# Altium project 海关全向控制器主控板V2.PrjPcb
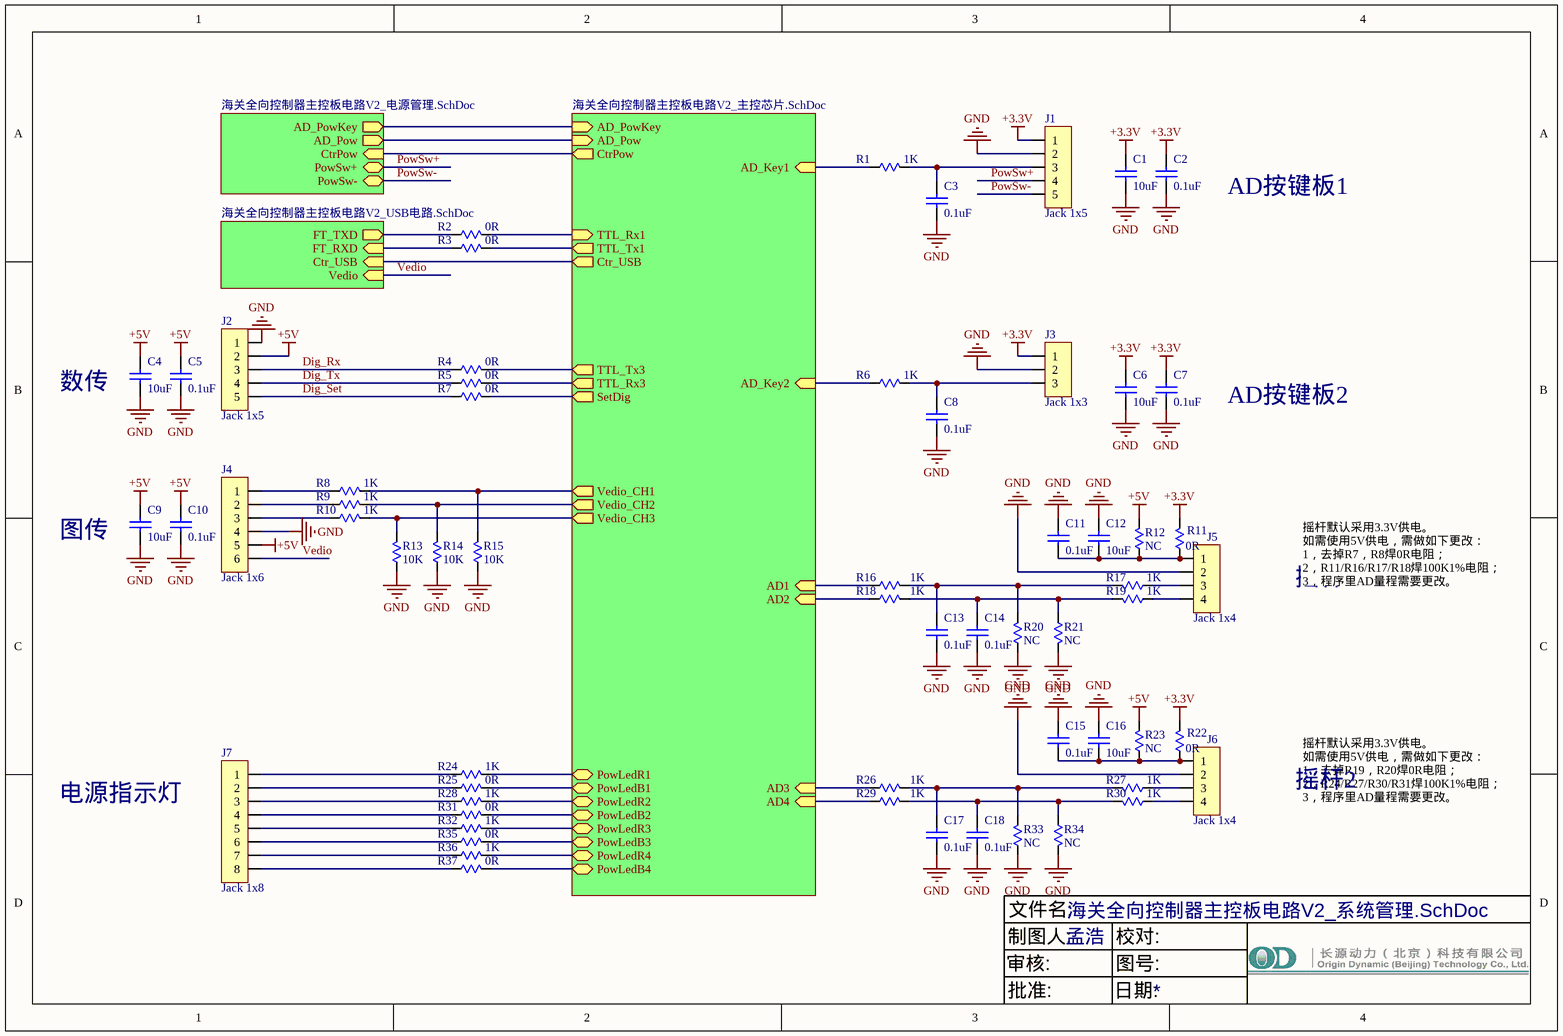
[diagram p0: 海关全向控制器主控板电路V2_系统管理.SchDoc]
4 sheets, 192 parts. Net scope: hierarchical (ports join the sheet entries above them; power ports are global).
Board file: 海关全向控制器主控板电路V2.PcbDoc
Sheets:
  海关全向控制器主控板电路V2_系统管理.SchDoc
    Designator = 海关全向控制器主控板电路V2_电源管理.SchDoc
    Designator = 海关全向控制器主控板电路V2_USB电路.SchDoc
    Designator = 海关全向控制器主控板电路V2_主控芯片.SchDoc

## Sheet 海关全向控制器主控板电路V2_系统管理.SchDoc
size A4

### Parts
C1  10uF  [C0603]
C2  0.1uF  [C0603]
C3  0.1uF  [C0603]
C4  10uF  [C0603]
C5  0.1uF  [C0603]
C6  10uF  [C0603]
C7  0.1uF  [C0603]
C8  0.1uF  [C0603]
C9  10uF  [C0603]
C10  0.1uF  [C0603]
C11  0.1uF  [C0603]
C12  10uF  [C0603]
C13  0.1uF  [C0603]
C14  0.1uF  [C0603]
C15  0.1uF  [C0603]
C16  10uF  [C0603]
C17  0.1uF  [C0603]
C18  0.1uF  [C0603]
J1  Jack 1x5  [ZH-5AWD]
J2  Jack 1x5  [ZH-5AWD]
J3  Jack 1x3  [ZH-3AWD]
J4  Jack 1x6  [ZH-6AWD]
J5  Jack 1x4  [ZH-4AWD]
J6  Jack 1x4  [ZH-4AWD]
J7  Jack 1x8  [ZH-8AWD]
R1  1K  [R0603]
R2  0R  [R0603]
R3  0R  [R0603]
R4  0R  [R0603]
R5  0R  [R0603]
R6  1K  [R0603]
R7  0R  [R0603]
R8  1K  [R0603]
R9  1K  [R0603]
R10  1K  [R0603]
R11  0R  [R0603]
R12  NC  [R0603]
R13  10K  [R0603]
R14  10K  [R0603]
R15  10K  [R0603]
R16  1K  [R0603]
R17  1K  [R0603]
R18  1K  [R0603]
R19  1K  [R0603]
R20  NC  [R0603]
R21  NC  [R0603]
R22  0R  [R0603]
R23  NC  [R0603]
R24  1K  [R0603]
R25  0R  [R0603]
R26  1K  [R0603]
R27  1K  [R0603]
R28  1K  [R0603]
R29  1K  [R0603]
R30  1K  [R0603]
R31  0R  [R0603]
R32  1K  [R0603]
R33  NC  [R0603]
R34  NC  [R0603]
R35  0R  [R0603]
R36  1K  [R0603]
R37  0R  [R0603]

### Sub-sheets
Designator = 海关全向控制器主控板电路V2_电源管理.SchDoc: AD_PowKey (out), AD_Pow (out), CtrPow (in), PowSw+ (bidir), PowSw- (bidir)
Designator = 海关全向控制器主控板电路V2_USB电路.SchDoc: FT_RXD (in), FT_TXD (out), Vedio (in), Ctr_USB (in)
Designator = 海关全向控制器主控板电路V2_主控芯片.SchDoc: AD_PowKey (in), AD_Pow (in), CtrPow (out), TTL_Rx1 (in), TTL_Tx1 (out), AD_Key1 (in), AD1 (in), AD2 (in), AD3 (in), AD4 (in), TTL_Tx3 (out), TTL_Rx3 (out), Vedio_CH1 (out), Vedio_CH2 (out), Vedio_CH3 (out), AD_Key2 (in), PowLedR1 (bidir), PowLedR2 (bidir), PowLedR3 (bidir), PowLedB1 (bidir), PowLedB2 (bidir), PowLedB3 (bidir), SetDig (out), Ctr_USB (out), PowLedR4 (bidir), PowLedB4 (bidir)

### Nets
+3.3V: C1.1 C2.1 C6.1 C7.1 J1.1 J3.1 R11.1 R22.1
+5V: C4.1 C5.1 C9.1 C10.1 J2.2 J4.5 R12.1 R23.1
GND: C1.2 C2.2 C3.2 C4.2 C5.2 C6.2 C7.2 C8.2 C9.2 C10.2 C11.1 C12.1 C13.2 C14.2 C15.1 C16.1 C17.2 C18.2 J1.2 J2.1 J3.2 J4.4 J5.2 J6.2 R13.1 R14.1 R15.1 R20.2 R21.1 R33.2 R34.1
AD1: R16.2 ; sheet Designator/AD1
AD2: R18.2 ; sheet Designator/AD2
AD3: R26.2 ; sheet Designator/AD3
AD4: R29.2 ; sheet Designator/AD4
AD_Key1: R1.1 ; sheet Designator/AD_Key1
AD_Key2: R6.1 ; sheet Designator/AD_Key2
AD_Pow: sheet Designator/AD_Pow, sheet Designator/AD_Pow
AD_PowKey: sheet Designator/AD_PowKey, sheet Designator/AD_PowKey
Ctr_USB: sheet Designator/Ctr_USB, sheet Designator/Ctr_USB
CtrPow: sheet Designator/CtrPow, sheet Designator/CtrPow
Dig_Rx: J2.3 R4.1
Dig_Set: J2.5 R7.1
Dig_Tx: J2.4 R5.1
PowLedB1: R25.2 ; sheet Designator/PowLedB1
PowLedB2: R31.2 ; sheet Designator/PowLedB2
PowLedB3: R35.2 ; sheet Designator/PowLedB3
PowLedB4: R37.2 ; sheet Designator/PowLedB4
PowLedR1: R24.2 ; sheet Designator/PowLedR1
PowLedR2: R28.2 ; sheet Designator/PowLedR2
PowLedR3: R32.2 ; sheet Designator/PowLedR3
PowLedR4: R36.2 ; sheet Designator/PowLedR4
PowSw+: J1.4 ; sheet Designator/PowSw+
PowSw-: J1.5 ; sheet Designator/PowSw-
SetDig: R7.2 ; sheet Designator/SetDig
TTL_Rx1: R2.1 ; sheet Designator/TTL_Rx1
TTL_Rx3: R5.2 ; sheet Designator/TTL_Rx3
TTL_Tx1: R3.1 ; sheet Designator/TTL_Tx1
TTL_Tx3: R4.2 ; sheet Designator/TTL_Tx3
Vedio: J4.6 ; sheet Designator/Vedio
Vedio_CH1: R8.2 R15.2 ; sheet Designator/Vedio_CH1
Vedio_CH2: R9.2 R14.2 ; sheet Designator/Vedio_CH2
Vedio_CH3: R10.2 R13.2 ; sheet Designator/Vedio_CH3
NetC3_1: C3.1 J1.3 R1.2
NetC8_1: C8.1 J3.3 R6.2
NetC11_2: C11.2 C12.2 J5.1 R11.2 R12.2
NetC13_1: C13.1 R16.1 R17.1 R20.1
NetC14_1: C14.1 R18.1 R19.1 R21.2
NetC15_2: C15.2 C16.2 J6.1 R22.2 R23.2
NetC17_1: C17.1 R26.1 R27.1 R33.1
NetC18_1: C18.1 R29.1 R30.1 R34.2
NetJ4_1: J4.1 R8.1
NetJ4_2: J4.2 R9.1
NetJ4_3: J4.3 R10.1
NetJ5_3: J5.3 R17.2
NetJ5_4: J5.4 R19.2
NetJ6_3: J6.3 R27.2
NetJ6_4: J6.4 R30.2
NetJ7_1: J7.1 R24.1
NetJ7_2: J7.2 R25.1
NetJ7_3: J7.3 R28.1
NetJ7_4: J7.4 R31.1
NetJ7_5: J7.5 R32.1
NetJ7_6: J7.6 R35.1
NetJ7_7: J7.7 R36.1
NetJ7_8: J7.8 R37.1
NetR2_2: R2.2 ; sheet Designator/FT_TXD
NetR3_2: R3.2 ; sheet Designator/FT_RXD

### Notes on the sheet
- AD按键板1
- 数传
- AD按键板2
- 图传
- 摇杆默认采用3.3V供电。
  如需使用5V供电，需做如下更改：
  1，去掉R7，R8焊0R电阻；
  2，R11/R16/R17/R18焊100K1%电阻；
  3，程序里AD量程需要更改。
- 摇杆1
- 摇杆2
- 电源指示灯
- 摇杆默认采用3.3V供电。
  如需使用5V供电，需做如下更改：
  1，去掉R19，R20焊0R电阻；
  2，R24/R27/R30/R31焊100K1%电阻；
  3，程序里AD量程需要更改。
- 文件名:
- 审核:
- 制图人:
- 孟浩
- 校对:
- 图号:
- 批准:
- 日期:

### Library data of the parts
C1-C18 = Cap: Capacitor; Published: 8-Jun-2000; Revision: July-2002: Re-released for DXP Platform.; Publisher: Altium Limited
  C1 C4 C6 C9 C12 C16: Value: 10uF
  C2 C3 C5 C7 C8 C10 C11 C13-C15 C17 C18: Value: 0.1uF
J1 J2 = Jack 1x5: 插座
J3 = Jack 1x3: 插座
J4 = Jack 1x6: 插座
J5 J6 = Jack 1x4: 插座
J7 = Jack 1x8: 插座
R1-R37 = Res: Resistor; Published: 8-Jun-2000; LatestRevisionDate: 04-Mar-2005; LatestRevisionNote: PCB Footprint replaced.; PackageReference: J1-0603; Publisher: Altium Limited
  R1 R6 R8-R10 R16-R19 R26 R27 R29 R30: Value: 1K
  R2-R5 R7 R11 R22 R25 R31 R35 R37: Value: 0R
  R12 R20 R21 R23 R33 R34: Value: NC
  R13-R15: Value: 10K

## Sheet 海关全向控制器主控板电路V2_电源管理.SchDoc
size A4
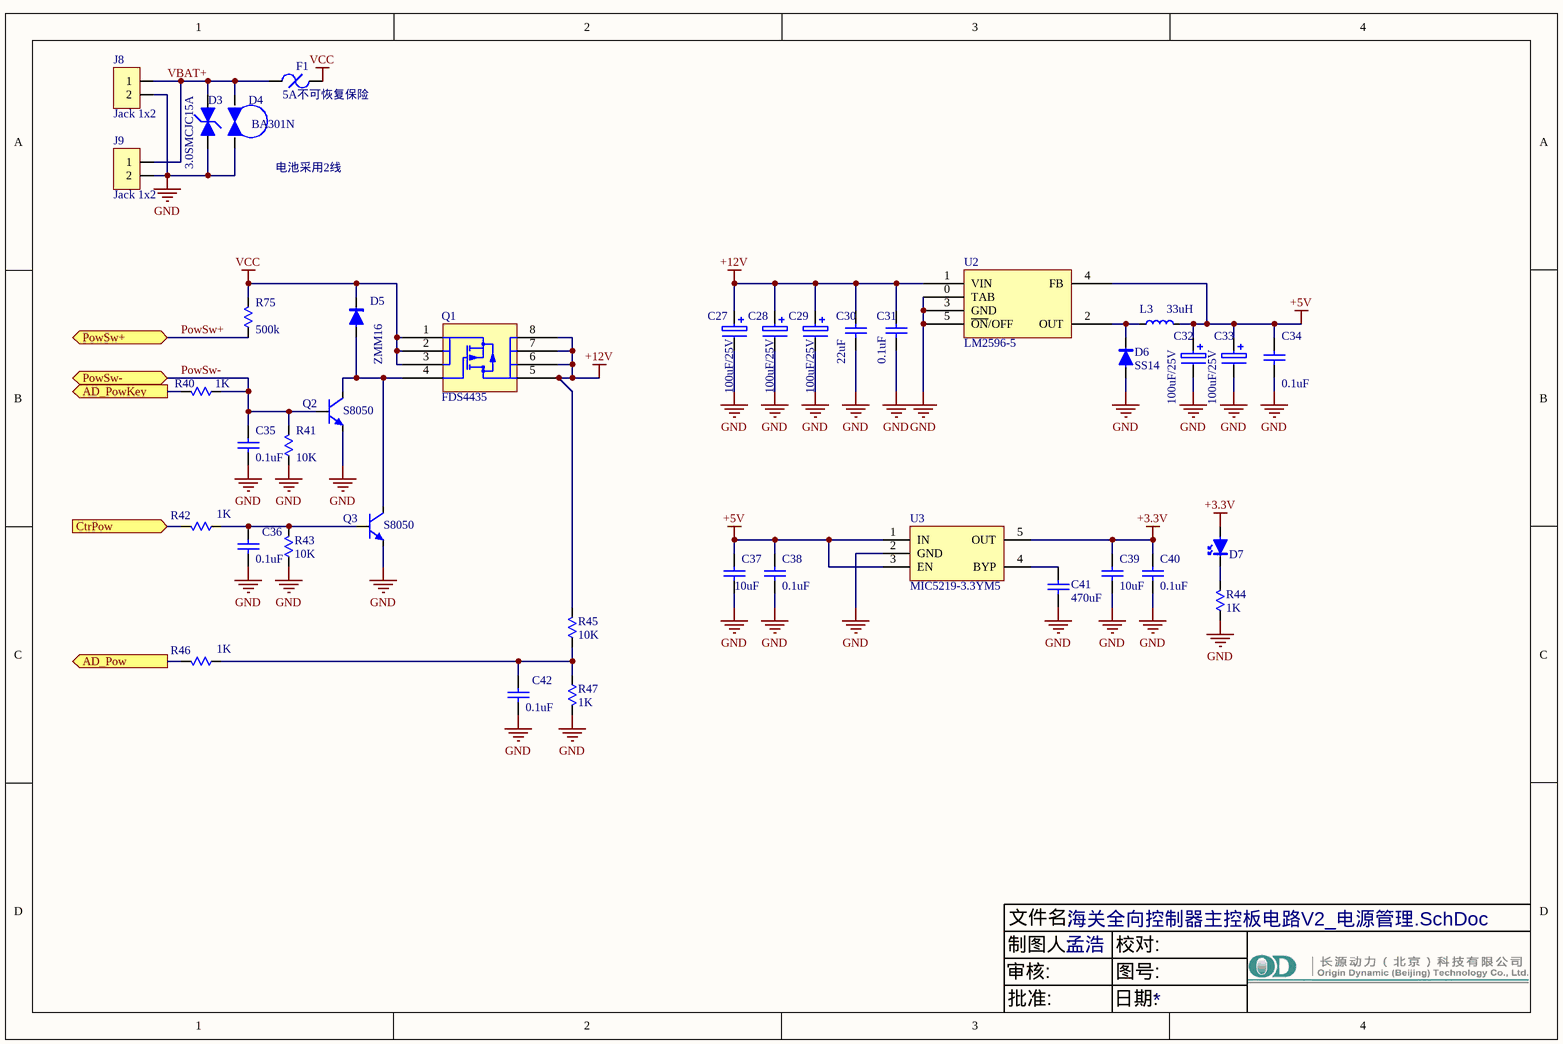
[diagram p1: 海关全向控制器主控板电路V2_电源管理.SchDoc]

### Parts
C27  100uF/25V  [C7343]
C28  100uF/25V  [C7343]
C29  100uF/25V  [C7343]
C30  22uF  [C1206]
C31  0.1uF  [C1206]
C32  100uF/25V  [C7343]
C33  100uF/25V  [C7343]
C34  0.1uF  [C0603]
C35  0.1uF  [C0603]
C36  0.1uF  [C0603]
C37  10uF  [C0603]
C38  0.1uF  [C0603]
C39  10uF  [C0603]
C40  0.1uF  [C0603]
C41  470uF  [C0603]
C42  0.1uF  [C0603]
D3  3.0SMCJC15A  [smc]
D4  BA301N  [BA301N]
D5  ZMM16  [SOD-80-S]
D6  SS14  [SMA]
D7  LED  [LED0603]  (value not drawn)
F1  5A不可恢复保险  [F1218]
J8  Jack 1x2  [ZH-2AWD]
J9  Jack 1x2  [ZH-2AWD]
L3  33uH  [L6.6*7.1mm]
Q1  FDS4435  [SO8]
Q2  S8050  [SOT-23]
Q3  S8050  [SOT-23]
R40  1K  [R0603]
R41  10K  [R0603]
R42  1K  [R0603]
R43  10K  [R0603]
R44  1K  [R0603]
R45  10K  [R0603]
R46  1K  [R0603]
R47  1K  [R0603]
R75  500k  [R0603]
U2  LM2596-5  [TO-263-5]
U3  MIC5219-3.3YM5  [SOT-23-5]

### Ports
AD_Pow (out), AD_PowKey (out), CtrPow (in), PowSw+ (bidir), PowSw- (bidir)

### Nets
+3.3V: C39.1 C40.2 D7.1(A) U3.5(OUT)
+5V: C32.1 C33.1 C34.2 C37.1 C38.2 L3.2 U2.4(FB) U3.1(IN) U3.3(EN)
+12V: C27.1 C28.1 C29.1 C30.1 C31.1 Q1.5 Q1.6 Q1.7 Q1.8 R45.1 U2.1(VIN)
GND: C27.2 C28.2 C29.2 C30.2 C31.2 C32.2 C33.2 C34.1 C35.1 C36.1 C37.2 C38.1 C39.2 C40.1 C41.1 C42.1 D3.2(K) D4.2 D6.1(A) J8.2 J9.2 Q2.2(E) Q3.2(E) R41.2 R43.2 R44.1 R47.1 U2.0(TAB) U2.3(GND) U2.5(~{ON}/OFF) U3.2(GND)
VCC: D5.2(K) F1.2 Q1.1 Q1.2 Q1.3 R75.2
AD_Pow: R46.1 ; port AD_Pow
AD_PowKey: R40.1 ; port AD_PowKey
CtrPow: R42.1 ; port CtrPow
PowSw+: R75.1 ; port PowSw+
PowSw-: C35.2 Q2.1(B) R40.2 R41.1 ; port PowSw-
VBAT+: D3.1(A) D4.1 F1.1 J8.1 J9.1
NetC36_2: C36.2 Q3.1(B) R42.2 R43.1
NetC41_2: C41.2 U3.4(BYP)
NetC42_2: C42.2 R45.2 R46.2 R47.2
NetD5_1: D5.1(A) Q1.4 Q2.3(C) Q3.3(C)
NetD6_2: D6.2(K) L3.1 U2.2(OUT)
NetD7_2: D7.2(K) R44.2

### Notes on the sheet
- 电池采用2线
- 文件名:
- 审核:
- 制图人:
- 孟浩
- 校对:
- 图号:
- 批准:
- 日期:

### Library data of the parts
C27-C29 = Cap Poll
C30 C31 C34-C40 C42 = CAP: Published: 8-Jun-2000; LatestRevisionDate: 17-Jul-2002; LatestRevisionNote: Re-released for DXP Platform.; PackageReference: RAD-0.3; Publisher: Altium Limited
  C30: Value: 22uF
  C31 C34-C36 C38 C40 C42: Value: 0.1uF
  C37 C39: Value: 10uF
C32 C33 = ELECTRO: Electrolytic Capacitor
C41 = Cap Semi
D3 = Diode-TVS
D5 = DIODE-ZENER: Small Signal Zener Diodes
D6 = Diode-Switch: Silicon Epitaxial Planar Diodes
F1 = Fuse2
J8 J9 = Jack 1x2: 插座
L3 = INDUCTOR: Code_IEC: 1005; Published: 8-Jun-2000; LatestRevisionDate: 17-Jul-2002; LatestRevisionNote: Re-released for DXP Platform.; PackageReference: 0402-A; Publisher: Altium Limited; Code_JEITA: 0402
Q2 Q3 = NPN: NPN General Purpose Amplifier; Published: 8-Jun-2000; LatestRevisionDate: 15-Jan-2003; LatestRevisionNote: PCB Footprint 'BCY-W3/D4.7' replaced; DatasheetDocument: 1997; PackageDocument: Sep-1998; PackageReference: TO-92A; Publisher: Altium Limited; Code_JEDEC: TO-92A; ComponentLink1Description: Manufacturer Link; ComponentLink1URL: http://www.fairchildsemi.com/; ComponentLink2Description: Datasheet; ComponentLink2URL: http://www.fairchildsemi.com/ds/2N%2F2N3904.pdf
R40-R47 R75 = Res: Resistor; Published: 8-Jun-2000; LatestRevisionDate: 04-Mar-2005; LatestRevisionNote: PCB Footprint replaced.; PackageReference: J1-0603; Publisher: Altium Limited
  R41 R43 R45: Value: 10K
  R42 R44 R46 R47: Value: 1K
  R75: Value: 500k
U2 = LM25x6-5: LM2596-5;LM2576-5
U3 = MIC5205

## Sheet 海关全向控制器主控板电路V2_USB电路.SchDoc
size A4
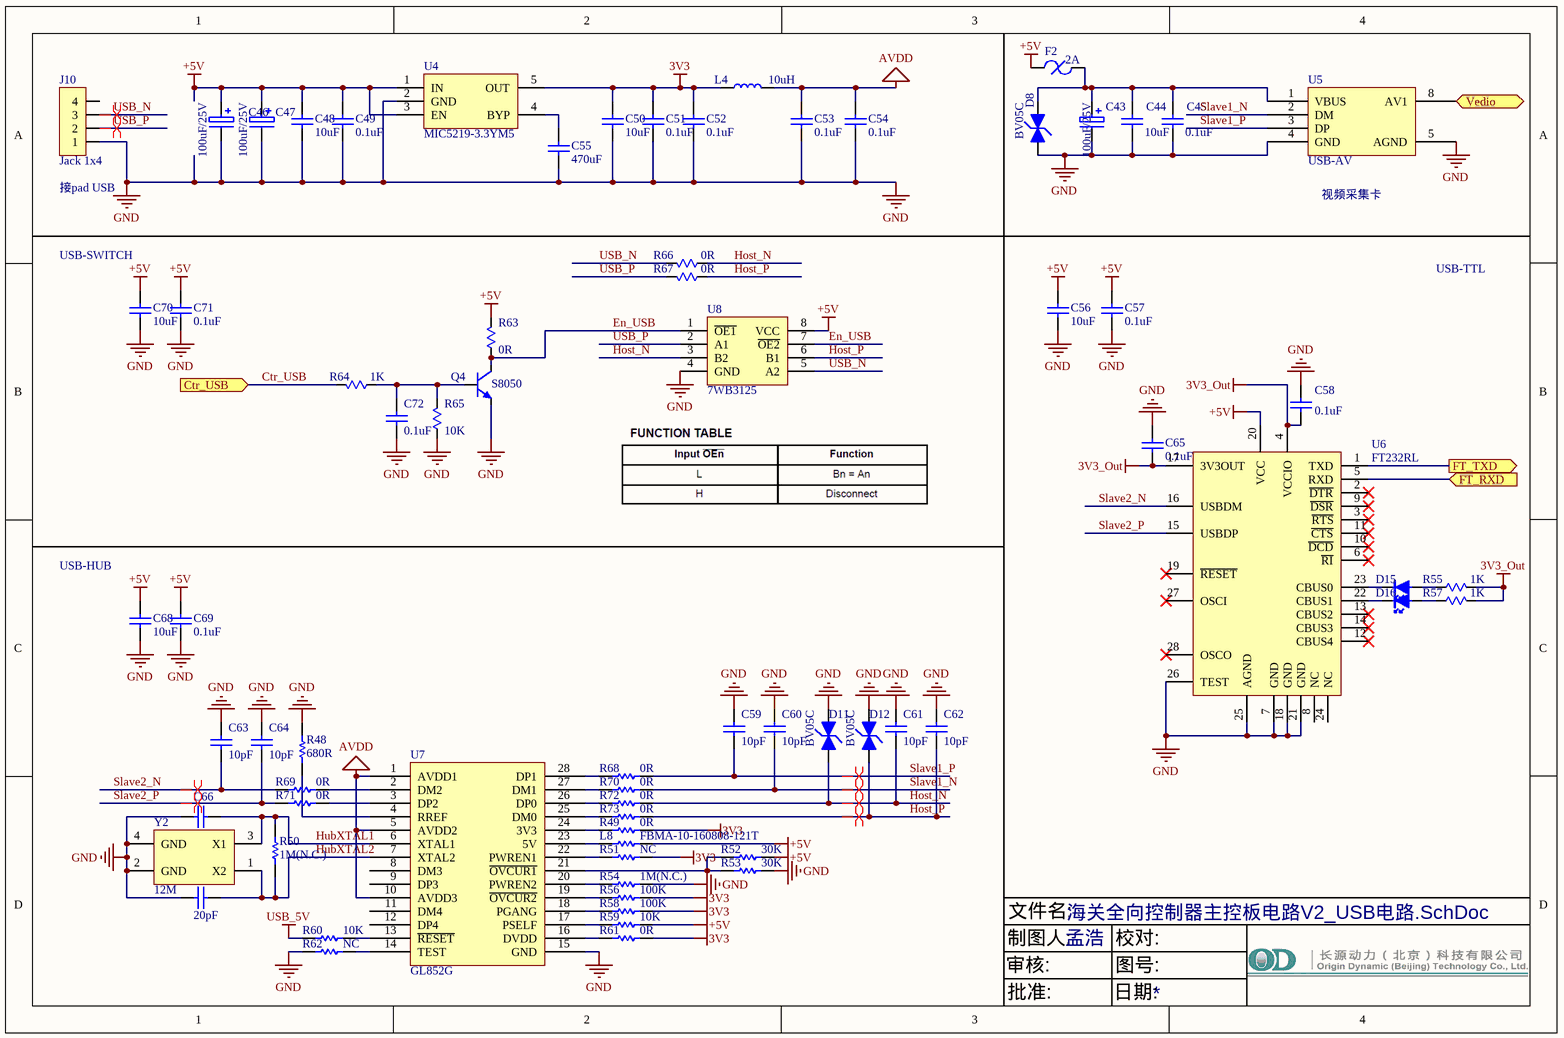
[diagram p2: 海关全向控制器主控板电路V2_USB电路.SchDoc]

### Parts
C43  100uF/25V  [C7343]
C44  10uF  [C0603]
C45  0.1uF  [C0603]
C46  100uF/25V  [C7343]
C47  100uF/25V  [C7343]
C48  10uF  [C0603]
C49  0.1uF  [C0603]
C50  10uF  [C0603]
C51  0.1uF  [C0603]
C52  0.1uF  [C0603]
C53  0.1uF  [C0603]
C54  0.1uF  [C0603]
C55  470uF  [C0603]
C56  10uF  [C0603]
C57  0.1uF  [C0603]
C58  0.1uF  [C0603]
C59  10pF  [C0603]
C60  10pF  [C0603]
C61  10pF  [C0603]
C62  10pF  [C0603]
C63  10pF  [C0603]
C64  10pF  [C0603]
C65  0.1uF  [C0603]
C66  20pF  [C0603]
C67  20pF  [C0603]
C68  10uF  [C0603]
C69  0.1uF  [C0603]
C70  10uF  [C0603]
C71  0.1uF  [C0603]
C72  0.1uF  [C0603]
D8  BV05C  [SOD323]
D11  BV05C  [SOD323]
D12  BV05C  [SOD323]
D15  LED  [LED0603]  (value not drawn)
D16  LED  [LED0603]  (value not drawn)
F2  2A  [F1218]
J10  Jack 1x4  [ZH-4AWD]
L4  10uH  [L0603]
L8  FBMA-10-160808-121T  [R0603]
Q4  S8050  [SOT-23]
R48  680R  [R0603]
R49  0R  [R0603]
R50  1M(N.C.)  [R0603]
R51  NC  [R0603]
R52  30K  [R0603]
R53  30K  [R0603]
R54  1M(N.C.)  [R0603]
R55  1K  [R0603]
R56  100K  [R0603]
R57  1K  [R0603]
R58  100K  [R0603]
R59  10K  [R0603]
R60  10K  [R0603]
R61  0R  [R0603]
R62  NC  [R0603]
R63  0R  [R0603]
R64  1K  [R0603]
R65  10K  [R0603]
R66  0R  [R0603]
R67  0R  [R0603]
R68  0R  [R0603]
R69  0R  [R0603]
R70  0R  [R0603]
R71  0R  [R0603]
R72  0R  [R0603]
R73  0R  [R0603]
U4  MIC5219-3.3YM5  [SOT-23-5]
U5  USB-AV  [USB-AV]
U6  FT232RL  [SSOP-28]
U7  GL852G  [SSOP-28]
U8  7WB3125  [Micro8]
Y2  12M  [XTAL3225]

### Ports
Ctr_USB (in), FT_RXD (in), FT_TXD (out), Vedio (in)

### Nets
3V3: C50.1 C51.2 C52.2 L4.1 R49.1 R51.1 R56.1 R58.1 R61.1 U4.5(OUT)
3V3_Out: C58.2 C65.1 R55.1 R57.1 U6.4(VCCIO) U6.17(3V3OUT)
+5V: C46.1 C47.1 C48.1 C49.2 C56.1 C57.2 C68.1 C69.2 C70.1 C71.2 F2.1 L8.2 R52.1 R59.1 R63.1 U4.1(IN) U4.3(EN) U6.20(VCC) U8.8(VCC)
AVDD: C53.2 C54.2 L4.2 U7.1(AVDD1) U7.5(AVDD2) U7.10(AVDD3)
GND: C43.2 C44.2 C45.1 C46.2 C47.2 C48.2 C49.1 C50.2 C51.1 C52.1 C53.1 C54.1 C55.1 C56.2 C57.1 C58.1 C59.2 C60.2 C61.2 C62.2 C63.2 C64.2 C65.2 C66.2 C67.2 C68.2 C69.1 C70.2 C71.1 C72.1 D8.2(K) D11.1(A) D12.1(A) J10.1 Q4.2(E) R48.2 R53.1 R54.1 R62.2 R65.2 U4.2(GND) U5.4(GND) U5.5(AGND) U6.7(GND) U6.18(GND) U6.21(GND) U6.25(AGND) U6.26(TEST) U7.15(GND) U8.4(GND) Y2.2(GND) Y2.4(GND)
USB_5V: R60.2
Ctr_USB: R64.1 ; port Ctr_USB
En_USB: Q4.3(C) R63.2 U8.1(~{OE1}) U8.7(~{OE2})
Host_N: C61.1 D11.2(K) R66.2 R72.1 U8.3(B2)
Host_P: C62.1 D12.2(K) R67.2 R73.1 U8.6(B1)
HubXTAL1: C66.1 R50.2 U7.6(XTAL1) Y2.3(X1)
HubXTAL2: C67.1 R50.1 U7.7(XTAL2) Y2.1(X2)
Slave1_N: C60.1 R70.1 U5.2(DM)
Slave1_P: C59.1 R68.1 U5.3(DP)
Slave2_N: C63.1 R69.2 U6.16(USBDM)
Slave2_P: C64.1 R71.2 U6.15(USBDP)
USB_N: J10.3 R66.1 U8.5(A2)
USB_P: J10.2 R67.1 U8.2(A1)
Vedio: U5.8(AV1) ; port Vedio
NetC43_1: C43.1 C44.1 C45.2 D8.1(A) F2.2 U5.1(VBUS)
NetC55_2: C55.2 U4.4(BYP)
NetC72_2: C72.2 Q4.1(B) R64.2 R65.1
NetD15_1: D15.1(A) R55.2
NetD15_2: D15.2(K) U6.23(CBUS0)
NetD16_1: D16.1(A) R57.2
NetD16_2: D16.2(K) U6.22(CBUS1)
NetL8_1: L8.1 U7.23(5V)
NetR2_2: U6.1(TXD) ; port FT_TXD
NetR3_2: U6.5(RXD) ; port FT_RXD
NetR48_1: R48.1 U7.4(RREF)
NetR49_2: R49.2 U7.24(3V3)
NetR51_2: R51.2 U7.22(PWREN1)
NetR52_2: R52.2 R53.2 U7.21(~{OVCUR1})
NetR54_2: R54.2 U7.20(PWREN2)
NetR56_2: R56.2 U7.19(~{OVCUR2})
NetR58_2: R58.2 U7.18(PGANG)
NetR59_2: R59.2 U7.17(PSELF)
NetR60_1: R60.1 U7.13(~{RESET})
NetR61_2: R61.2 U7.16(DVDD)
NetR62_1: R62.1 U7.14(TEST)
NetR68_2: R68.2 U7.28(DP1)
NetR69_1: R69.1 U7.2(DM2)
NetR70_2: R70.2 U7.27(DM1)
NetR71_1: R71.1 U7.3(DP2)
NetR72_2: R72.2 U7.26(DP0)
NetR73_2: R73.2 U7.25(DM0)

Not connected (* = marked no-connect by the designer): J10 4; U6 2(~{DTR})* 3(~{RTS})* 6(~{RI})* 8(NC) 9(~{DSR})* 10(~{DCD})* 11(~{CTS})* 12(CBUS4)* 13(CBUS2)* 14(CBUS3)* 19(~{RESET})* 24(NC) 27(OSCI)* 28(OSCO)*; U7 8(DM3) 9(DP3) 11(DM4) 12(DP4)

### Layout directives
differential pair: Host_N, Host_P, Slave1_N, Slave1_P, Slave2_N, Slave2_P, USB_N, USB_P

### Notes on the sheet
- (near J10) 接pad USB
- (near U5) 视频采集卡
- (near C70) USB-SWITCH
- USB-TTL
- USB-HUB
- 文件名:
- 审核:
- 制图人:
- 孟浩
- 校对:
- 图号:
- 批准:
- 日期:

### Library data of the parts
C43 C46 C47 = Cap Poll
C44 C48 C50 C56 C68 C70 C72 = CAP: Published: 8-Jun-2000; LatestRevisionDate: 17-Jul-2002; LatestRevisionNote: Re-released for DXP Platform.; PackageReference: RAD-0.3; Publisher: Altium Limited
  C44 C48 C50 C56 C68 C70: Value: 10uF
  C72: Value: 0.1uF
C45 C49 C51-C55 C57 C59-C67 C69 C71 = Cap Semi
C58 = Cap: Capacitor; Value: 22pF; Published: 8-Jun-2000; Revision: July-2002: Re-released for DXP Platform.; Publisher: Altium Limited
D8 D11 D12 = Diode-TVS
F2 = Fuse2
J10 = Jack 1x4: 插座
L4 = Inductor
L8 R48-R54 R56 R58-R62 R68-R73 = Res
Q4 = NPN: NPN General Purpose Amplifier; Published: 8-Jun-2000; LatestRevisionDate: 15-Jan-2003; LatestRevisionNote: PCB Footprint 'BCY-W3/D4.7' replaced; DatasheetDocument: 1997; PackageDocument: Sep-1998; PackageReference: TO-92A; Publisher: Altium Limited; Code_JEDEC: TO-92A; ComponentLink1Description: Manufacturer Link; ComponentLink1URL: http://www.fairchildsemi.com/; ComponentLink2Description: Datasheet; ComponentLink2URL: http://www.fairchildsemi.com/ds/2N%2F2N3904.pdf
R55 R57 R63-R67 = Res: Resistor; Published: 8-Jun-2000; LatestRevisionDate: 04-Mar-2005; LatestRevisionNote: PCB Footprint replaced.; PackageReference: J1-0603; Publisher: Altium Limited
  R55 R57: Value: 1K
  R63 R66 R67: Value: 0R
  R65: Value: 10K
U4 = MIC5205
U7 = GL850G: USB 2.0 Low-Power HUB Controller
Y2 = XTAL3225

## Sheet 海关全向控制器主控板电路V2_主控芯片.SchDoc
size A4
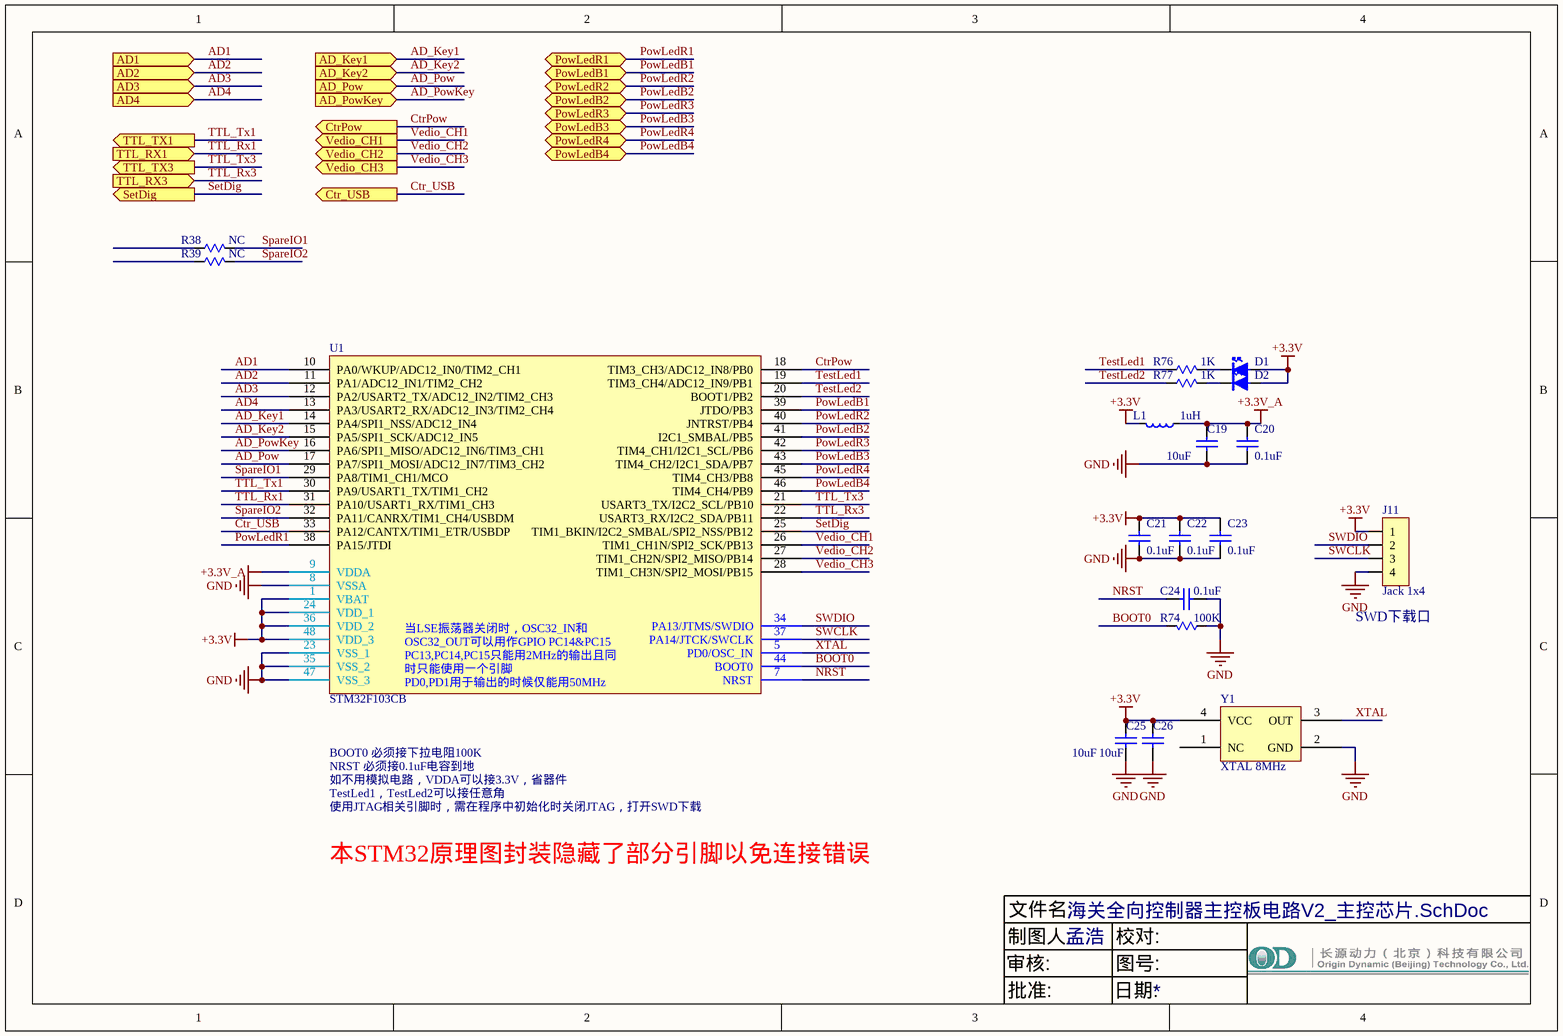
[diagram p3: 海关全向控制器主控板电路V2_主控芯片.SchDoc]

### Parts
C19  10uF  [C0603]
C20  0.1uF  [C0603]
C21  0.1uF  [C0603]
C22  0.1uF  [C0603]
C23  0.1uF  [C0603]
C24  0.1uF  [C0603]
C25  10uF  [C0603]
C26  10uF  [C0603]
D1  LED  [LED0603]  (value not drawn)
D2  LED  [LED0603]  (value not drawn)
J11  Jack 1x4  [Jk1*4-2.0]
L1  1uH  [L0603]
R38  NC  [R0603]
R39  NC  [R0603]
R74  100K  [R0603]
R76  1K  [R0603]
R77  1K  [R0603]
U1  STM32F103CB  [LQF48]
Y1  XTAL 8MHz  [XTAL5032]

### Ports
AD1 (in), AD2 (in), AD3 (in), AD4 (in), AD_Key1 (in), AD_Key2 (in), AD_Pow (in), AD_PowKey (in), Ctr_USB (out), CtrPow (out), PowLedB1 (bidir), PowLedB2 (bidir), PowLedB3 (bidir), PowLedB4 (bidir), PowLedR1 (bidir), PowLedR2 (bidir), PowLedR3 (bidir), PowLedR4 (bidir), SetDig (out), TTL_RX1 (in), TTL_RX3 (in), TTL_TX1 (out), TTL_TX3 (out), Vedio_CH1 (out), Vedio_CH2 (out), Vedio_CH3 (out)

### Nets
+3.3V: C21.1 C22.1 C23.1 C25.2 C26.2 D1.1(A) D2.1(A) J11.1 L1.1 U1.1(VBAT) U1.24(VDD_1) U1.36(VDD_2) U1.48(VDD_3) Y1.4(VCC)
+3.3V_A: C19.2 C20.1 L1.2 U1.9(VDDA)
GND: C19.1 C20.2 C21.2 C22.2 C23.2 C24.2 C25.1 C26.1 J11.4 R74.1 U1.8(VSSA) U1.23(VSS_1) U1.35(VSS_2) U1.47(VSS_3) Y1.2(GND)
AD1: U1.10(PA0/WKUP/ADC12_IN0/TIM2_CH1) ; port AD1
AD2: U1.11(PA1/ADC12_IN1/TIM2_CH2) ; port AD2
AD3: U1.12(PA2/USART2_TX/ADC12_IN2/TIM2_CH3) ; port AD3
AD4: U1.13(PA3/USART2_RX/ADC12_IN3/TIM2_CH4) ; port AD4
AD_Key1: U1.14(PA4/SPI1_NSS/ADC12_IN4) ; port AD_Key1
AD_Key2: U1.15(PA5/SPI1_SCK/ADC12_IN5) ; port AD_Key2
AD_Pow: U1.17(PA7/SPI1_MOSI/ADC12_IN7/TIM3_CH2) ; port AD_Pow
AD_PowKey: U1.16(PA6/SPI1_MISO/ADC12_IN6/TIM3_CH1) ; port AD_PowKey
BOOT0: R74.2 U1.44(BOOT0)
Ctr_USB: U1.33(PA12/CANTX/TIM1_ETR/USBDP) ; port Ctr_USB
CtrPow: U1.18(TIM3_CH3/ADC12_IN8/PB0) ; port CtrPow
NRST: C24.1 U1.7(NRST)
PowLedB1: U1.39(JTDO/PB3) ; port PowLedB1
PowLedB2: U1.41(I2C1_SMBAL/PB5) ; port PowLedB2
PowLedB3: U1.43(TIM4_CH2/I2C1_SDA/PB7) ; port PowLedB3
PowLedB4: U1.46(TIM4_CH4/PB9) ; port PowLedB4
PowLedR1: U1.38(PA15/JTDI) ; port PowLedR1
PowLedR2: U1.40(JNTRST/PB4) ; port PowLedR2
PowLedR3: U1.42(TIM4_CH1/I2C1_SCL/PB6) ; port PowLedR3
PowLedR4: U1.45(TIM4_CH3/PB8) ; port PowLedR4
SetDig: U1.25(TIM1_BKIN/I2C2_SMBAL/SPI2_NSS/PB12) ; port SetDig
SpareIO1: R38.2 U1.29(PA8/TIM1_CH1/MCO)
SpareIO2: R39.2 U1.32(PA11/CANRX/TIM1_CH4/USBDM)
SWCLK: J11.3 U1.37(PA14/JTCK/SWCLK)
SWDIO: J11.2 U1.34(PA13/JTMS/SWDIO)
TestLed1: R76.1 U1.19(TIM3_CH4/ADC12_IN9/PB1)
TestLed2: R77.1 U1.20(BOOT1/PB2)
TTL_Rx1: U1.31(PA10/USART1_RX/TIM1_CH3) ; port TTL_RX1
TTL_Rx3: U1.22(USART3_RX/I2C2_SDA/PB11) ; port TTL_RX3
TTL_Tx1: U1.30(PA9/USART1_TX/TIM1_CH2) ; port TTL_TX1
TTL_Tx3: U1.21(USART3_TX/I2C2_SCL/PB10) ; port TTL_TX3
Vedio_CH1: U1.26(TIM1_CH1N/SPI2_SCK/PB13) ; port Vedio_CH1
Vedio_CH2: U1.27(TIM1_CH2N/SPI2_MISO/PB14) ; port Vedio_CH2
Vedio_CH3: U1.28(TIM1_CH3N/SPI2_MOSI/PB15) ; port Vedio_CH3
XTAL: U1.5(PD0/OSC_IN) Y1.3(OUT)
NetD1_2: D1.2(K) R76.2
NetD2_2: D2.2(K) R77.2

Not connected (* = marked no-connect by the designer): R38 1; R39 1; U1 2(PC13-TAMPER-RTC) 3(PC14-OSC32_IN) 4(PC15-OSC32_OUT) 6(PD1/OSC_OUT); Y1 1(NC)

### Notes on the sheet
- (near J11) SWD下载口
- BOOT0 必须接下拉电阻100K
- NRST 必须接0.1uF电容到地
- 如不用模拟电路，VDDA可以接3.3V，省器件
- TestLed1，TestLed2可以接任意角
- 使用JTAG相关引脚时，需在程序中初始化时关闭JTAG，打开SWD下载
- 本STM32原理图封装隐藏了部分引脚以免连接错误
- 文件名:
- 审核:
- 制图人:
- 孟浩
- 校对:
- 图号:
- 批准:
- 日期:
- (in symbol STM32F103Cx) OSC32_IN和OSC32_OUT可以用作通用IO PC14和PC15; PC13,PC14,PC15只能用于2MHz的输出模式且同时只能使用一个引脚; 当LSE振荡器关闭时，OSC32_IN和OSC32_OUT可以用作GPIO PC14&PC15 / PC13,PC14,PC15只能用2MHz的输出且同时只能使用一个引脚 / PD0,PD1用于输出的时候仅能用50MHz

### Library data of the parts
C19-C26 = Cap: Capacitor; Published: 8-Jun-2000; Publisher: Altium Limited
  C19 C25 C26: LatestRevisionDate: 17-Jul-2002; LatestRevisionNote: Re-released for DXP Platform.; PackageReference: RAD-0.3; Value: 10uF
  C20-C24: Revision: July-2002: Re-released for DXP Platform.; Value: 0.1uF
J11 = Jack 1x4: 插座
L1 = INDUCTOR: Code_IEC: 1005; Published: 8-Jun-2000; LatestRevisionDate: 17-Jul-2002; LatestRevisionNote: Re-released for DXP Platform.; PackageReference: 0402-A; Publisher: Altium Limited; Code_JEITA: 0402; Value: 1uH
R38 R39 = Res: Resistor; Value: 1K; Published: 8-Jun-2000; LatestRevisionDate: 04-Mar-2005; LatestRevisionNote: PCB Footprint replaced.; PackageReference: J1-0603; Publisher: Altium Limited
R74 = RES: Resistor; Published: 8-Jun-2000; LatestRevisionDate: 17-Jul-2002; LatestRevisionNote: Re-released for DXP Platform.; PackageReference: AXIAL-0.3; Publisher: Altium Limited; Value: 100K
R76 R77 = Res: Resistor; Published: 8-Jun-2000; LatestRevisionDate: 04-Mar-2005; LatestRevisionNote: PCB Footprint replaced.; PackageReference: J1-0603; Publisher: Altium Limited; Value: 1K
U1 = STM32F103Cx
Y1 = XTAL

## Nets that join several sheets
+3.3V: 海关全向控制器主控板电路V2_系统管理 (8 pins), 海关全向控制器主控板电路V2_电源管理 (C39.1 C40.2 D7.1 U3.5), 海关全向控制器主控板电路V2_主控芯片 (14 pins)
+5V: 海关全向控制器主控板电路V2_系统管理 (8 pins), 海关全向控制器主控板电路V2_电源管理 (9 pins), 海关全向控制器主控板电路V2_USB电路 (19 pins)
GND: 海关全向控制器主控板电路V2_系统管理 (31 pins), 海关全向控制器主控板电路V2_电源管理 (31 pins), 海关全向控制器主控板电路V2_USB电路 (52 pins), 海关全向控制器主控板电路V2_主控芯片 (15 pins)
AD1: 海关全向控制器主控板电路V2_系统管理 (R16.2), 海关全向控制器主控板电路V2_主控芯片 (U1.10)
AD2: 海关全向控制器主控板电路V2_系统管理 (R18.2), 海关全向控制器主控板电路V2_主控芯片 (U1.11)
AD3: 海关全向控制器主控板电路V2_系统管理 (R26.2), 海关全向控制器主控板电路V2_主控芯片 (U1.12)
AD4: 海关全向控制器主控板电路V2_系统管理 (R29.2), 海关全向控制器主控板电路V2_主控芯片 (U1.13)
AD_Key1: 海关全向控制器主控板电路V2_系统管理 (R1.1), 海关全向控制器主控板电路V2_主控芯片 (U1.14)
AD_Key2: 海关全向控制器主控板电路V2_系统管理 (R6.1), 海关全向控制器主控板电路V2_主控芯片 (U1.15)
AD_Pow: 海关全向控制器主控板电路V2_电源管理 (R46.1), 海关全向控制器主控板电路V2_主控芯片 (U1.17)
AD_PowKey: 海关全向控制器主控板电路V2_电源管理 (R40.1), 海关全向控制器主控板电路V2_主控芯片 (U1.16)
Ctr_USB: 海关全向控制器主控板电路V2_USB电路 (R64.1), 海关全向控制器主控板电路V2_主控芯片 (U1.33)
CtrPow: 海关全向控制器主控板电路V2_电源管理 (R42.1), 海关全向控制器主控板电路V2_主控芯片 (U1.18)
NetR2_2: 海关全向控制器主控板电路V2_系统管理 (R2.2), 海关全向控制器主控板电路V2_USB电路 (U6.1)
NetR3_2: 海关全向控制器主控板电路V2_系统管理 (R3.2), 海关全向控制器主控板电路V2_USB电路 (U6.5)
PowLedB1: 海关全向控制器主控板电路V2_系统管理 (R25.2), 海关全向控制器主控板电路V2_主控芯片 (U1.39)
PowLedB2: 海关全向控制器主控板电路V2_系统管理 (R31.2), 海关全向控制器主控板电路V2_主控芯片 (U1.41)
PowLedB3: 海关全向控制器主控板电路V2_系统管理 (R35.2), 海关全向控制器主控板电路V2_主控芯片 (U1.43)
PowLedB4: 海关全向控制器主控板电路V2_系统管理 (R37.2), 海关全向控制器主控板电路V2_主控芯片 (U1.46)
PowLedR1: 海关全向控制器主控板电路V2_系统管理 (R24.2), 海关全向控制器主控板电路V2_主控芯片 (U1.38)
PowLedR2: 海关全向控制器主控板电路V2_系统管理 (R28.2), 海关全向控制器主控板电路V2_主控芯片 (U1.40)
PowLedR3: 海关全向控制器主控板电路V2_系统管理 (R32.2), 海关全向控制器主控板电路V2_主控芯片 (U1.42)
PowLedR4: 海关全向控制器主控板电路V2_系统管理 (R36.2), 海关全向控制器主控板电路V2_主控芯片 (U1.45)
PowSw+: 海关全向控制器主控板电路V2_系统管理 (J1.4), 海关全向控制器主控板电路V2_电源管理 (R75.1)
PowSw-: 海关全向控制器主控板电路V2_系统管理 (J1.5), 海关全向控制器主控板电路V2_电源管理 (C35.2 Q2.1 R40.2 R41.1)
SetDig: 海关全向控制器主控板电路V2_系统管理 (R7.2), 海关全向控制器主控板电路V2_主控芯片 (U1.25)
TTL_Rx1: 海关全向控制器主控板电路V2_系统管理 (R2.1), 海关全向控制器主控板电路V2_主控芯片 (U1.31)
TTL_Rx3: 海关全向控制器主控板电路V2_系统管理 (R5.2), 海关全向控制器主控板电路V2_主控芯片 (U1.22)
TTL_Tx1: 海关全向控制器主控板电路V2_系统管理 (R3.1), 海关全向控制器主控板电路V2_主控芯片 (U1.30)
TTL_Tx3: 海关全向控制器主控板电路V2_系统管理 (R4.2), 海关全向控制器主控板电路V2_主控芯片 (U1.21)
Vedio: 海关全向控制器主控板电路V2_系统管理 (J4.6), 海关全向控制器主控板电路V2_USB电路 (U5.8)
Vedio_CH1: 海关全向控制器主控板电路V2_系统管理 (R8.2 R15.2), 海关全向控制器主控板电路V2_主控芯片 (U1.26)
Vedio_CH2: 海关全向控制器主控板电路V2_系统管理 (R9.2 R14.2), 海关全向控制器主控板电路V2_主控芯片 (U1.27)
Vedio_CH3: 海关全向控制器主控板电路V2_系统管理 (R10.2 R13.2), 海关全向控制器主控板电路V2_主控芯片 (U1.28)